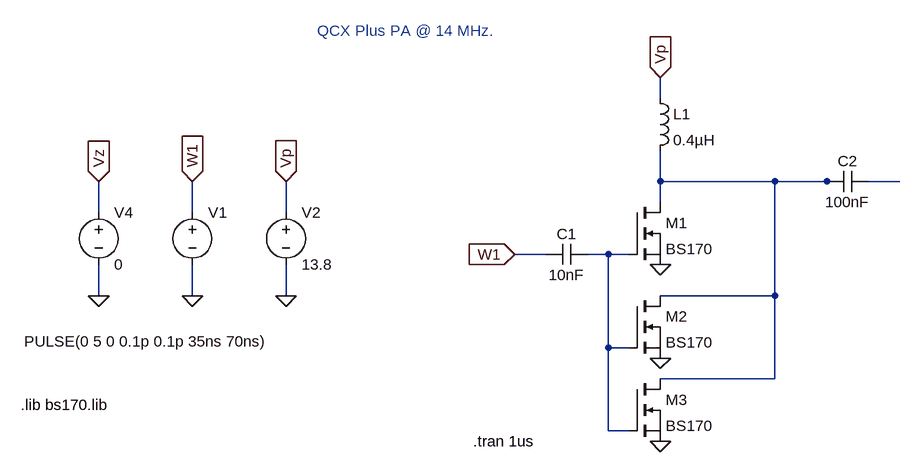
[diagram p0: schematic HF-PA-v2-Simulation-14-MHz-v1.asc]
HF-PA-v2-Simulation-14-MHz-v1.asc, the LTspice schematic file:
Version 4
SHEET 1 880 680
WIRE 128 -192 128 -224
WIRE 128 -64 128 -112
WIRE 304 -64 128 -64
WIRE 384 -64 304 -64
WIRE 400 -64 384 -64
WIRE 496 -64 448 -64
WIRE 128 -32 128 -64
WIRE -736 -16 -736 -64
WIRE -592 -16 -592 -64
WIRE -448 -16 -448 -64
WIRE -48 48 -96 48
WIRE 48 48 16 48
WIRE 80 48 48 48
WIRE -736 112 -736 64
WIRE -592 112 -592 64
WIRE -448 112 -448 64
WIRE 304 112 304 -64
WIRE 304 112 128 112
WIRE 48 192 48 48
WIRE 80 192 48 192
WIRE 304 240 304 112
WIRE 304 240 128 240
WIRE 48 320 48 192
WIRE 80 320 48 320
FLAG -96 48 W1
IOPIN -96 48 In
FLAG -592 112 0
FLAG -448 112 0
FLAG -592 -64 W1
IOPIN -592 -64 In
FLAG -448 -64 Vp
IOPIN -448 -64 In
FLAG -736 -64 Vz
IOPIN -736 -64 In
FLAG -736 112 0
FLAG 128 -224 Vp
IOPIN 128 -224 In
FLAG 128 208 0
FLAG 128 64 0
FLAG 128 336 0
SYMBOL voltage -592 -32 R0
WINDOW 3 -259 214 Left 2
WINDOW 123 0 0 Left 0
WINDOW 39 0 0 Left 0
SYMATTR Value PULSE(0 5 0 0.1p 0.1p 35ns 70ns)
SYMATTR InstName V1
SYMBOL voltage -448 -32 R0
WINDOW 123 0 0 Left 0
WINDOW 39 0 0 Left 0
SYMATTR InstName V2
SYMATTR Value 13.8
SYMBOL cap 16 32 R90
WINDOW 0 0 32 VBottom 2
WINDOW 3 32 32 VTop 2
SYMATTR InstName C1
SYMATTR Value 10nF
SYMBOL voltage -736 -32 R0
WINDOW 123 0 0 Left 0
WINDOW 39 0 0 Left 0
SYMATTR InstName V4
SYMATTR Value 0
SYMBOL nmos 80 -32 R0
SYMATTR InstName M1
SYMATTR Value BS170
SYMBOL nmos 80 112 R0
SYMATTR InstName M2
SYMATTR Value BS170
SYMBOL nmos 80 240 R0
SYMATTR InstName M3
SYMATTR Value BS170
SYMBOL ind 112 -208 R0
SYMATTR InstName L1
SYMATTR Value 0.4µH
SYMBOL cap 448 -80 R90
WINDOW 0 0 32 VBottom 2
WINDOW 3 32 32 VTop 2
SYMATTR InstName C2
SYMATTR Value 100nF
TEXT -160 336 Left 2 !.tran 1us
TEXT -400 -296 Left 2 ;QCX Plus PA @ 14 MHz.
TEXT -856 280 Left 2 !.lib bs170.lib

The netlist it stands for:
* HF-PA-v2-Simulation-14-MHz-v1.asc
V1 W1 0 PULSE(0 5 0 0.1p 0.1p 35ns 70ns)
V2 Vp 0 13.8
C1 N003 W1 10nF
V4 Vz 0 0
M1 N001 N003 0 0 BS170
M2 N001 N003 0 0 BS170
M3 N001 N003 0 0 BS170
L1 Vp N001 0.4µH
C2 N002 N001 100nF
.model NMOS NMOS
.model PMOS PMOS
.lib standard.mos
.tran 1us
* QCX Plus PA @ 14 MHz.
.lib bs170.lib
.backanno
.end